# EAGLE design OctoWatchScheme (EAGLE 9.5.2)
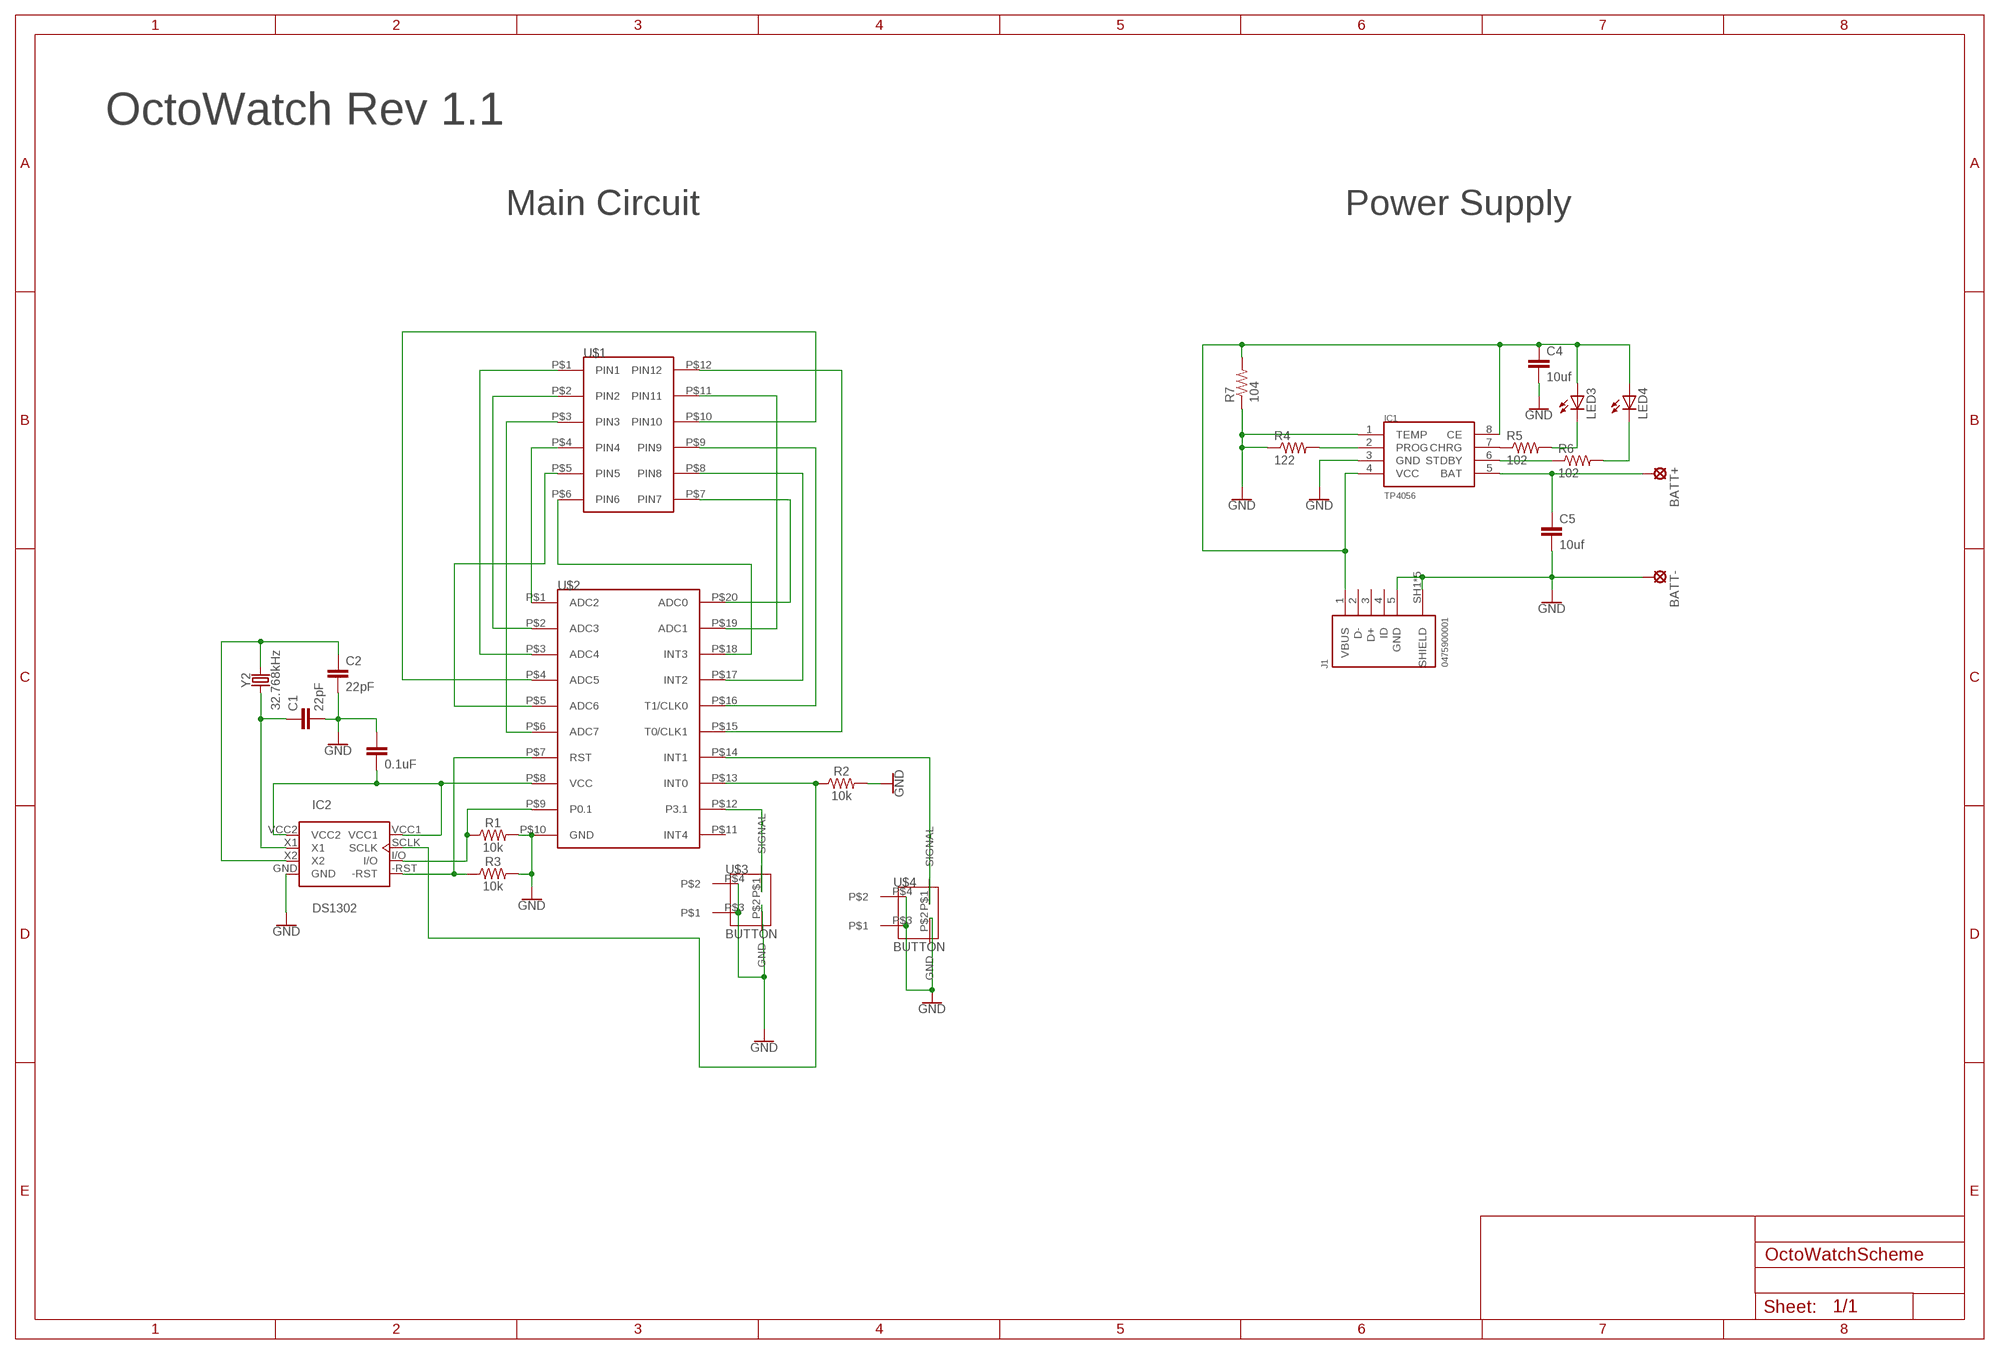
[diagram p0: schematic, sheet 1]

## Parts
BATT+  LSP13  [LSP13]
BATT-  LSP13  [LSP13]
C1  22pF  22PF-0402T-16V-10%  [0402-TIGHT]
C2  22pF  22PF-0402T-16V-10%  [0402-TIGHT]
C3  0.1uF  0.1UF-0402-6.3V-10%-X7R  [0402]
C4  10uf  C-EUC0805  [C0805]
C5  10uf  C-EUC0805  [C0805]
IC1  TP4056  [SOP-8]
IC2  DS1302  [DIL08]
J1  0475900001  [0475900001]
LED3  LEDCHIPLED_0603  [CHIPLED_0603]
LED4  LEDCHIPLED_0603  [CHIPLED_0603]
R1  10k  10KOHM-0603-1/10W-1%  [0603]
R2  10k  10KOHM-0603-1/10W-1%  [0603]
R3  10k  10KOHM-0603-1/10W-1%  [0603]
R4  122  R-US_R0402  [R0402]
R5  102  R-US_R0402  [R0402]
R6  102  R-US_R0402  [R0402]
R7  104  R-US_R0805  [R0805]
U$1  LED_SEGMENT  [LED_SEGMENT]
U$2  STC15F204AESTC15L204AE  [STC15F204AE2]
U$3  BUTTON  [BUTTON]
U$4  BUTTON  [BUTTON]
Y2  32.768kHz  CRYSTAL-32.768KHZPTH-2X6  [CRYSTAL-PTH-2X6-CYL]

## Nets
BATT+: C3.2 IC2.VCC1 IC2.VCC2 U$2.P$8(VCC)
GND: BATT-.MP C1.2 C2.2 C3.1 C4.2 C5.2 IC1.1(TEMP) IC1.3(GND) IC2.GND J1.5(GND) J1.SH1(SHIELD) J1.SH2(SHIELD) J1.SH3(SHIELD) J1.SH4(SHIELD) J1.SH5(SHIELD) R1.2 R2.2 R3.2 R4.1 R7.1 U$2.P$10(GND) U$3.P$2(GND) U$3.P$3 U$3.P$4 U$4.P$2(GND) U$4.P$3 U$4.P$4
N$1: U$1.P$1(PIN1) U$2.P$3(ADC4)
N$2: U$1.P$2(PIN2) U$2.P$2(ADC3)
N$3: U$1.P$4(PIN4) U$2.P$1(ADC2)
N$4: U$1.P$3(PIN3) U$2.P$6(ADC7)
N$5: U$1.P$5(PIN5) U$2.P$5(ADC6)
N$6: U$1.P$6(PIN6) U$2.P$18(INT3)
N$7: U$1.P$7(PIN7) U$2.P$20(ADC0)
N$8: U$1.P$8(PIN8) U$2.P$17(INT2)
N$9: U$1.P$9(PIN9) U$2.P$16(T1/CLK0)
N$10: U$1.P$10(PIN10) U$2.P$4(ADC5)
N$11: U$1.P$11(PIN11) U$2.P$19(ADC1)
N$12: U$1.P$12(PIN12) U$2.P$15(T0/CLK1)
N$13: C1.1 IC2.X1 Y2.1
N$14: IC2.-RST R3.1 U$2.P$7(RST)
N$15: C2.1 IC2.X2 Y2.2
N$17: IC2.I/O R1.1 U$2.P$9(P0.1)
N$18: BATT+.MP C5.1 IC1.5(BAT)
N$19: U$2.P$14(INT1) U$4.P$1(SIGNAL)
N$20: U$2.P$12(P3.1) U$3.P$1(SIGNAL)
N$23: IC2.SCLK R2.1 U$2.P$13(INT0)
N$26: IC1.6(STDBY) R6.1
N$27: LED4.C R6.2
N$28: IC1.7(CHRG) R5.1
N$29: LED3.C R5.2
N$31: IC1.2(PROG) R4.2
N$32: C4.1 IC1.4(VCC) IC1.8(CE) J1.1(VBUS) LED3.A LED4.A R7.2
Unconnected: J1.2(D-) J1.3(D+) J1.4(ID) U$2.P$11(INT4)

## Notes on the sheet
- OctoWatch Rev 1.1
- Main Circuit | Power Supply

## Library data of the parts
BATT+ BATT- = solpad:LSP13: SOLDER PAD drill 1.3 mm, distributor Buerklin, 12H562
C1 C2 = SparkFun-Capacitors:22PF: 22pF ceramic capacitors A capacitor is a passive two-terminal electrical component used to store electrical energy temporarily in an electric field.; PROD_ID: CAP-14674
C3 = SparkFun-Capacitors:0.1UF: 0.1µF ceramic capacitors A capacitor is a passive two-terminal electrical component used to store electrical energy temporarily in an electric field.; PROD_ID: CAP-14993
C4 C5 = rcl:C-EU: CAPACITOR, European symbol; SPICEPREFIX: C
IC1 = TP4056:TP4056
IC2 = ds1302:DS1302: Real-time clock (RTC) counts seconds, minutes hours, date of the month, month, day of the week, and year with leap-year compensation valid up to 2100
J1 = USB connector:0475900001: CONN RCPT MICRO USB AB 5P SMD RA Manufacturer's datasheet <https://www.molex.com/pdm_docs/sd/475900001_sd.pdf>; CREATED_BY: PCBLayout.com; DIGIKEY_PARTNO: WM17144TR-ND; MANUFACTURER: Molex; MPN: 0475900001
LED3 LED4 = adafruit:LED: LED OSRAM: - CHIPLED LG R971, LG N971, LY N971, LG Q971, LY Q971, LO R971, LY R971 LH N974, LH R974 LS Q976, LO Q976, LY Q976 LO Q996 - Hyper CHIPLED LW Q18S LB Q993, LB Q99A, LB R99A - SideLED LS A670, LO A670, LY A670, LG A670, LP A670 LB A673, LV A673, LT A673, LW A673 LH A674 LY A675 LS A676, LA A676, LO A676, LY A676, LW A676 LS A679, LY A679, LG A679 - Hyper Micro SIDELED® LS Y876, LA Y876, LO Y876, LY Y876 LT Y87S - SmartLED LW L88C, LW L88S LB L89C, LB L89S, LG L890 LS L89K, LO L89K, LY L89K LS L896, LA L896, LO L896, LY L896 - TOPLED LS T670, LO T670, LY T670, LG T670, LP T670 LSG T670, LSP T670, LSY T670, LOP T670, LYG T670 LG T671, LOG T671, LSG T671 LB T673, LV T673, LT T673, LW T673 LH T674 LS T676, LA T676, LO T676, LY T676, LB T676, LH T676, LSB T676, LW T676 LB T67C, LV T67C, LT T67C, LS T67K, LO T67K, LY T67K, LW E67C LS E67B, LA E67B, LO E67B, LY E67B, LB E67C, LV E67C, LT E67C LW T67C LS T679, LY T679, LG T679 LS T770, LO T770, LY T770, LG T770, LP T770 LB T773, LV T773, LT T773, LW T773 LH T774 LS E675, LA E675, LY E675, LS T675 LS T776, LA T776, LO T776, LY T776, LB T776 LHGB T686 LT T68C, LB T68C - Hyper Mini TOPLED® LB M676 - Mini TOPLED Santana® LG M470 LS M47K, LO M47K, LY M47K Source: http://www.osram.convergy.de/
R1-R3 = SparkFun-Resistors:10KOHM: 10kΩ resistor A resistor is a passive two-terminal electrical component that implements electrical resistance as a circuit element. Resistors act to reduce current flow, and, at the same time, act to lower voltage levels within circuits. - Wikipedia; PROD_ID: RES-00824
R4-R7 = rcl:R-US_: RESISTOR, American symbol; SPICEPREFIX: R
U$1 = OctoWatch:LED_SEGMENT: 7 segment led LCD 7mm
U$2 = OctoWatch:STC15F204AE: 15L204AE microchip for watch
U$3 U$4 = OctoWatch:BUTTON
Y2 = SparkFun-Clocks:CRYSTAL-32.768KHZ: 32.768kHz Crystal Frequency: 32.768kHz Frequency Stability: ±20ppm Load Capacitance: 12.5pF (PTH-2X6 & SMD-3.2X1.5), 6pF (SMD-2X6) SparkFun Products: SparkFun BigTime Watch Kit <https://www.sparkfun.com/products/11734> SparkFun nRF52832 Breakout <https://www.sparkfun.com/products/13990> SparkFun Real Time Clock Module <https://www.sparkfun.com/products/12708>; PROD_ID: XTAL-10112

## Board
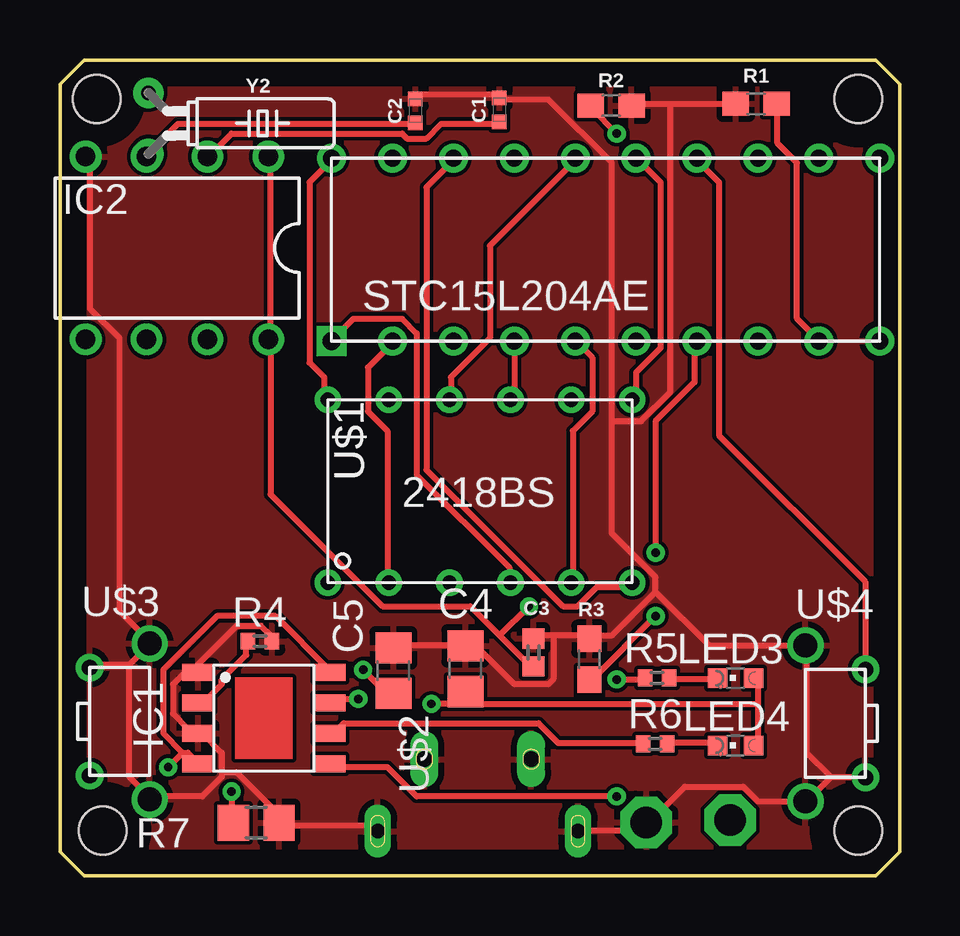
[diagram p1: board, top side]
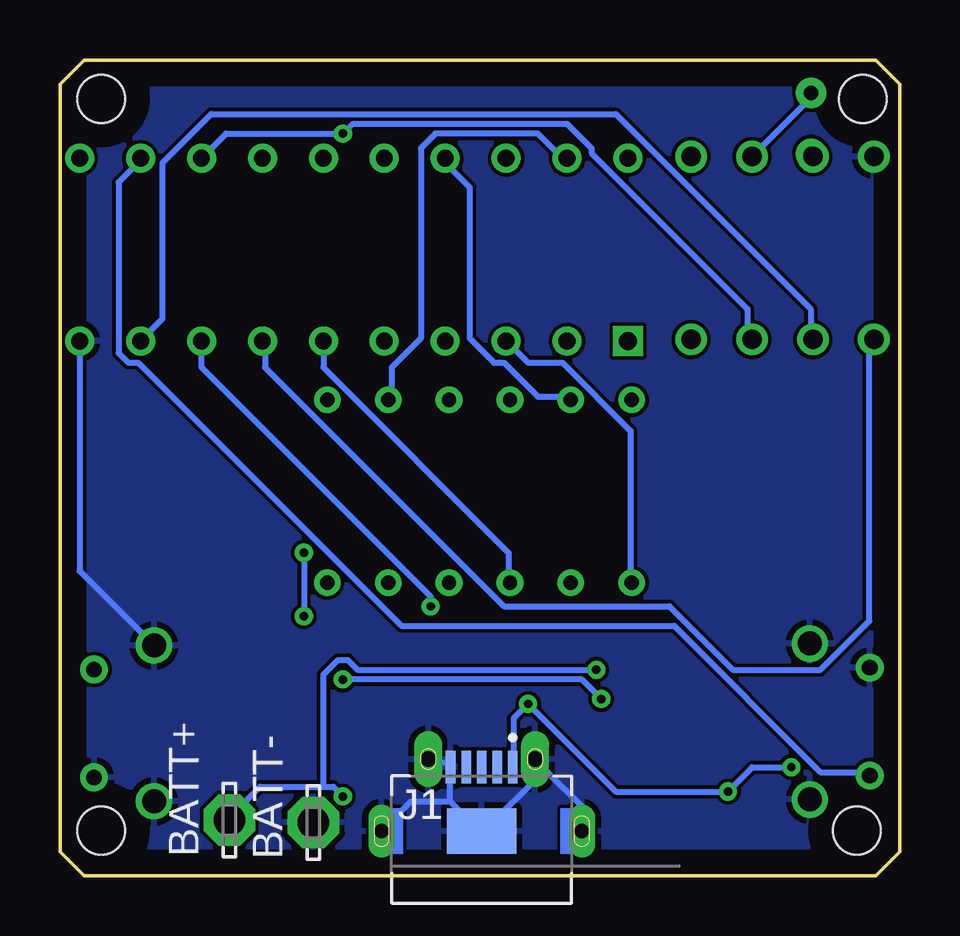
[diagram p2: board, bottom side, seen from below]

Size 35 x 34 mm. Coordinates in mm from the lower left corner, seen from the top.
Outline: 0,33 0,1 1,0 34,0 35,1 35,33 34,34 1,34 0,33
Copper layers (1*16): Top 0.035mm / dielectric 1.5mm / Bottom 0.035mm
Design rules "default *": minimum track width 10mil, minimum drill 0.35mm, track to track 6mil, track to pad 6mil, pad to pad 6mil, via to via 6mil, smd to smd 6mil, copper to edge 40mil, drill to drill 6mil, minimum pad ring 10mil, minimum via ring 8mil, stop-mask expansion 4mil, vias tented up to drill 0mil, thermal gap 10mil
Holes 2 mm at 33.28,32.38 1.53,32.38 1.78,1.88 33.28,1.88

### Footprints (pad centres in the part's own frame; a part is rotated, then mirrored left to right if it is on the bottom)
LSP13 = drill 1.321 pad 2.159 octagon: MP 0,0
0402-TIGHT = smd 0.6 x 0.6: 1 -0.5,0; 2 0.5,0
0402 = smd 0.85 x 0.9: 1 -0.58,0; 2 0.58,0
C0805 = smd 1.3 x 1.5: 1 -0.95,0; 2 0.95,0
SOP-8 = smd 1.3 x 0.7: 1 -2.75,1.905; 2 -2.75,0.635; 3 -2.75,-0.635; 4 -2.75,-1.905; 5 2.75,-1.905; 6 2.75,-0.635; 7 2.75,0.635; 8 2.75,1.905
DIL08 = drill 0.813: -RST 3.81,3.81; GND 3.81,-3.81; I/O 1.27,3.81; SCLK -1.27,3.81; VCC1 -3.81,3.81; VCC2 -3.81,-3.81; X1 -1.27,-3.81; X2 1.27,-3.81
0475900001 = smd 0.4 x 1.35: 1 1.3,2.675; 2 0.65,2.675; 3 0,2.675; 4 -0.65,2.675; 5 -1.3,2.675 | drill 0.65 pad 0.85 long: SH1 -2.225,3; SH2 2.225,3 | drill 0.6 pad 0.8 long: SH3 -4.175,0; SH4 4.175,0 | smd 2.9 x 1.9: SH5 0,0
CHIPLED_0603 = smd 0.8 x 0.8: A 0,-0.75; C 0,0.75
0603 = smd 1.1 x 1: 1 -0.85,0; 2 0.85,0
R0402 = smd 0.6 x 0.7: 1 -0.5,0; 2 0.5,0
R0805 = smd 1.3 x 1.5: 1 -0.95,0; 2 0.95,0
LED_SEGMENT = drill 0.6: P$1 -12.7,7.62; P$2 -12.7,5.08; P$3 -12.7,2.54; P$4 -12.7,0; P$5 -12.7,-2.54; P$6 -12.7,-5.08; P$7 -5.08,7.62; P$8 -5.08,5.08; P$9 -5.08,2.54; P$10 -5.08,0; P$11 -5.08,-2.54; P$12 -5.08,-5.08
STC15F204AE2 = drill 0.75 square: P$1 -12.7,10.16 | drill 0.7: P$2 -12.7,7.62; P$3 -12.7,5.08; P$4 -12.7,2.54; P$5 -12.7,0; P$6 -12.7,-2.54; P$7 -12.7,-5.08; P$8 -12.7,-7.62; P$9 -12.7,-10.16; P$10 -12.7,-12.7; P$11 -5.08,-12.7; P$12 -5.08,-10.16; P$13 -5.08,-7.62; P$14 -5.08,-5.08; P$15 -5.08,-2.54; P$16 -5.08,0; P$17 -5.08,2.54; P$18 -5.08,5.08; P$19 -5.08,7.62; P$20 -5.08,10.16
BUTTON = drill 0.65: P$1 -9,4.5; P$2 -9,0 | drill 1: P$3 -11.5,-1; P$4 -11.5,5.5
CRYSTAL-PTH-2X6-CYL = drill 0.6 pad 1.27: 1 -1.27,0; 2 1.27,0

### Placement (x,y rotation side)
BATT+  27.94,2.31 90 bottom
BATT-  24.44,2.21 90 bottom
C1  18.32,31.92 90 top
C2  14.82,31.88 90 top
C3  19.74,9.3 270 top
C4  16.9,8.62 90 top
C5  13.9,8.54 90 top
IC1  8.5,6.56 0 top
IC2  4.88,26.16 180 top
J1  17.42,1.85 0 bottom
LED3  28.17,8.23 90 top
LED4  28.17,5.42 90 top
R1  29.02,32.17 180 top
R2  22.98,32.09 0 top
R3  22.07,9.02 90 top
R4  8.34,9.77 180 top
R5  24.89,8.24 0 top
R6  24.81,5.49 0 top
R7  8.18,2.2 180 top
U$1  18.78,24.91 90 top
U$2  21.48,34.98 90 top
U$3  -7.76,8.67 180 top
U$4  42.58,4.09 0 top
Y2  3.69,31.36 270 top

### Tracks (layer width: path | path; a pad name or v marks a point on that pad's centre or on a via)
BATT+  (via drill 0.35)
  Top 0.254: 18.33,10 17.11,11.22 13.45,11.22 8.78,15.89 8.78,22.19 IC2.VCC1 8.78,22.4 8.78,29.91 IC2.VCC2 | 18.33,10 19.55,8.78 C3.2 | 18.33,10 v19.55,11.22
  Bottom 0.254: v19.55,11.22 19.55,11.63 29.1,21.18 29.1,22.19 U$2.P$8
GND
  Top 0.254: 17.11,9.8 16.91,9.6 C4.2 | 8.98,9.6 R4.1 | 13.86,9.6 C5.2 14.06,9.6 16.7,9.6 C4.2 | 5.32,5.73 5.73,5.73 IC1.3 | 5.32,8.58 5.53,8.58 | 5.53,8.58 5.73,8.58 IC1.1 | 14.67,32.35 C2.2 14.87,32.56 18.13,32.56 C1.2 18.33,32.35 20.36,32.35 23,29.71 23,18.94 | 5.32,6.14 5.32,5.73 | 5.32,5.73 IC1.3 | 8.78,10 8.78,9.8 R4.1 | 32.15,4.11 33.57,4.11 U$4.P$2 | 32.15,4.11 31.13,3.09 U$4.P$3 30.93,3.09 29.1,3.09 28.49,3.7 26.05,3.7 24.63,2.28 BATT-.MP 24.43,2.08 24.22,1.87 21.78,1.87 J1.SH3 | 32.15,4.11 31.13,5.12 31.13,9.39 U$4.P$4 30.93,9.6 27.07,9.6 24.83,11.83 | 25.44,32.15 28.08,32.15 R1.2 | 25.44,32.15 24.02,32.15 R2.2 | 20.56,10 21.99,10 R3.2 22.19,10 23,10 24.83,11.83 | 20.56,10 19.75,10 C3.1 | 23,18.94 23,14.27 24.83,12.44 24.83,11.83 | 17.11,9.8 18.94,7.97 20.36,7.97 20.56,8.17 20.56,10 | 17.11,9.8 C4.2 | 25.44,32.15 25.44,20.16 24.22,18.94 23,18.94 | 2.89,8.78 1.26,8.78 U$3.P$2 | 2.89,8.78 3.7,9.6 U$3.P$3 3.7,9.8 2.48,11.02 2.48,22.4 1.26,23.62 1.26,29.91 IC2.GND | J1.SH4 13.05,1.87 12.84,2.08 9.79,2.08 R7.1 8.98,2.28 8.98,2.69 7.36,4.31 6.75,4.31 | 8.78,10 8.37,10.41 7.36,10.41 5.53,8.58 | 8.78,10 R4.1 | 5.53,8.58 IC1.1 | 5.32,6.14 4.71,6.75 4.71,7.97 5.32,8.58 | 5.32,6.14 IC1.3 | 5.32,8.58 IC1.1 | 6.75,4.31 6.75,5.12 5.93,5.94 IC1.3 | 6.75,4.31 6.75,4.11 5.93,3.3 3.9,3.3 U$3.P$4 3.7,3.3 2.89,4.11 2.89,8.78
  Bottom 0.254: J1.SH1 19.55,4.72 18.73,4.72 J1.5 18.73,4.52 18.73,3.09 | 18.73,3.09 17.52,1.87 J1.SH5 17.31,1.87 14.87,4.31 14.67,4.31 | 18.73,3.09 20.36,3.09 21.58,1.87 J1.SH3 | 14.67,4.31 15.08,4.72 J1.SH2 14.67,4.31 | 14.67,4.31 13.25,2.89 13.25,1.87 J1.SH4 | U$2.P$10 34.18,12.69 U$4.P$4
  pour Top: 1.03,33.88 0.03,32.88 0.03,1.13 1.03,0.13 34.03,0.13 35.03,1.13 35.03,32.88 34.03,33.88 33.78,33.88
  pour Bottom: 1.03,33.88 0.28,33.13 0.28,1.13 1.28,0.13 33.78,0.13 34.78,1.13 34.78,32.88 33.78,33.88
N$1
  Bottom 0.254: U$1.P$1 11.22,12.24 11.22,18.54 14.06,21.38 15.48,21.38 16.3,22.19 U$2.P$3
N$2
  Top 0.254: U$1.P$2 13.66,12.24 13.66,18.54 12.84,19.35 12.84,21.18 13.86,22.19 U$2.P$2
N$3
  Top 0.254: U$1.P$4 18.73,12.24 18.73,12.85 14.87,16.71 14.87,22.6 14.27,23.21 12.23,23.21 11.42,22.4 U$2.P$1
N$4
  Bottom 0.254: U$1.P$3 16.3,12.24 16.3,13.46 24.02,21.18 24.02,22.19 U$2.P$6
N$5
  Top 0.254: U$1.P$5 21.38,12.24 21.38,18.54 22.19,19.35 22.19,21.58 21.58,22.19 U$2.P$5
N$6
  Top 0.254: U$1.P$6 23.81,12.03 22.39,12.03 21.58,11.22 20.97,11.22 15.28,16.91 15.28,28.7 16.3,29.71 U$2.P$18
N$7
  Top 0.254: U$1.P$7 11.01,19.96 11.01,20.77 10.4,21.38 10.4,28.9 11.22,29.71 U$2.P$20
N$8
  Bottom 0.254: U$1.P$8 13.86,19.96 15.08,19.96 16.5,21.38 16.91,21.38 17.92,22.4 17.92,28.7 18.94,29.71 U$2.P$17
N$9
  Top 0.254: U$1.P$9 16.3,19.96 16.3,20.77 17.92,22.4 17.92,26.26 21.38,29.71 U$2.P$16
N$10
  Top 0.254: U$1.P$10 18.94,19.96 18.94,22.19 U$2.P$4
N$11
  Bottom 0.254: U$1.P$11 21.17,19.96 21.17,21.18 19.95,22.4 19.95,30.32 19.34,30.93 15.08,30.93 14.06,29.91 U$2.P$19
N$12
  Top 0.254: U$1.P$12 24.02,19.96 24.02,20.97 25.03,21.99 25.03,28.9 24.22,29.71 U$2.P$15
N$13
  Top 0.254: C1.1 18.13,31.34 15.89,31.34 15.28,30.73 14.47,30.73 14.27,30.93 7.15,30.93 6.34,30.12 IC2.X1
  Bottom 0.254: IC2.X1 3.67,32.45 3.67,32.63 Y2.1
N$14  (via drill 0.35)
  Top 0.254: v24.83,10.81 22.19,8.17 R3.1 | v24.83,13.46 24.83,18.94 26.46,20.57 26.46,22.19 U$2.P$7
  Bottom 0.254: v24.83,13.46 v24.83,10.81 | IC2.-RST 1.26,22.19 1.26,10.61 3.29,8.58 6.95,8.58 9.59,11.22 16.5,11.22 26.46,21.18 26.46,22.19 U$2.P$7
N$15
  Top 0.254: C2.1 14.67,31.34 4.92,31.34 3.7,30.12 Y2.2 | Y2.2 IC2.X2 | Y2.2
N$17
  Top 0.254: R1.1 29.91,32.15 29.91,30.53 30.72,29.71 30.72,23.21 31.54,22.4 U$2.P$9
  Bottom 0.254: IC2.I/O 3.7,22.4 3.7,23.62 11.83,31.74 28.69,31.74 30.72,29.71 30.72,23.21 31.54,22.4 U$2.P$9
N$18  (via drill 0.35)
  Top 0.254: 13.86,7.56 C5.1 13.86,7.77 13.45,7.77 v12.64,8.58 | v23.21,3.3 14.87,3.3 13.66,4.52 11.42,4.52 IC1.5
  Bottom 0.254: v23.21,3.3 23.61,3.7 24.02,3.7 | 24.02,3.7 26.66,3.7 27.88,2.48 BATT+.MP | v12.64,8.58 22.6,8.58 23,8.99 23.41,8.99 24.02,8.38 24.02,3.7
N$19
  Top 0.254: U$4.P$1 33.57,8.78 33.57,12.25 27.47,18.35 27.47,28.9 26.66,29.71 U$2.P$14
N$20
  Bottom 0.254: U$3.P$1 1.26,4.31 3.29,4.31 9.39,10.41 20.77,10.41 31.74,21.38 32.15,21.38 32.55,21.79 32.55,28.9 31.74,29.71 U$2.P$12
N$23  (via drill 0.35)
  Top 0.254: 21.99,31.95 R2.1 22.19,31.95 v23.21,30.93
  Bottom 0.254: U$2.P$13 29.1,29.91 28.08,30.93 v23.21,30.93 22.8,31.34 13.86,31.34 12.84,30.32 12.84,30.12 6.34,23.62 6.34,22.4 IC2.SCLK
N$26
  Top 0.254: R6.1 24.22,5.53 20.77,5.53 19.95,6.34 11.83,6.34 11.42,5.94 IC1.6
N$27
  Top 0.254: R6.2 25.44,5.53 27.27,5.53 LED4.C
N$28  (via drill 0.35)
  Top 0.254: 11.42,7.16 IC1.7 11.42,7.36 v12.44,7.36 | v23.21,8.17 24.22,8.17 R5.1
  Bottom 0.254: v23.21,8.17 13.25,8.17 v12.44,7.36
N$29
  Top 0.254: R5.2 25.44,8.17 27.27,8.17 LED3.C
N$31
  Top 0.254: R4.2 7.76,9.6 7.76,9.19 6.75,8.17 6.75,7.97 5.93,7.16 IC1.2
N$32  (via drill 0.35)
  Top 0.254: 6.75,2.28 R7.2 7.15,2.28 v7.15,3.5 | 11.22,8.38 IC1.8 11.22,8.58 8.98,10.81 6.54,10.81 4.31,8.58 4.31,5.94 5.12,5.12 | 5.93,4.52 IC1.4 5.73,4.72 5.32,5.12 5.12,5.12 | 16.3,7.16 16.7,7.56 C4.1 | 29.1,7.16 29.1,8.17 LED3.A | 29.1,7.16 29.1,5.53 LED4.A | 16.3,7.16 v15.48,7.16 | 16.3,7.16 C4.1 | 29.1,7.16 17.31,7.16 16.91,7.56 C4.1 | v4.51,4.52 5.12,5.12
  Bottom 0.254: J1.1 16.09,4.72 16.09,6.55 v15.48,7.16 11.83,3.5 v7.15,3.5 6.14,4.52 v4.51,4.52